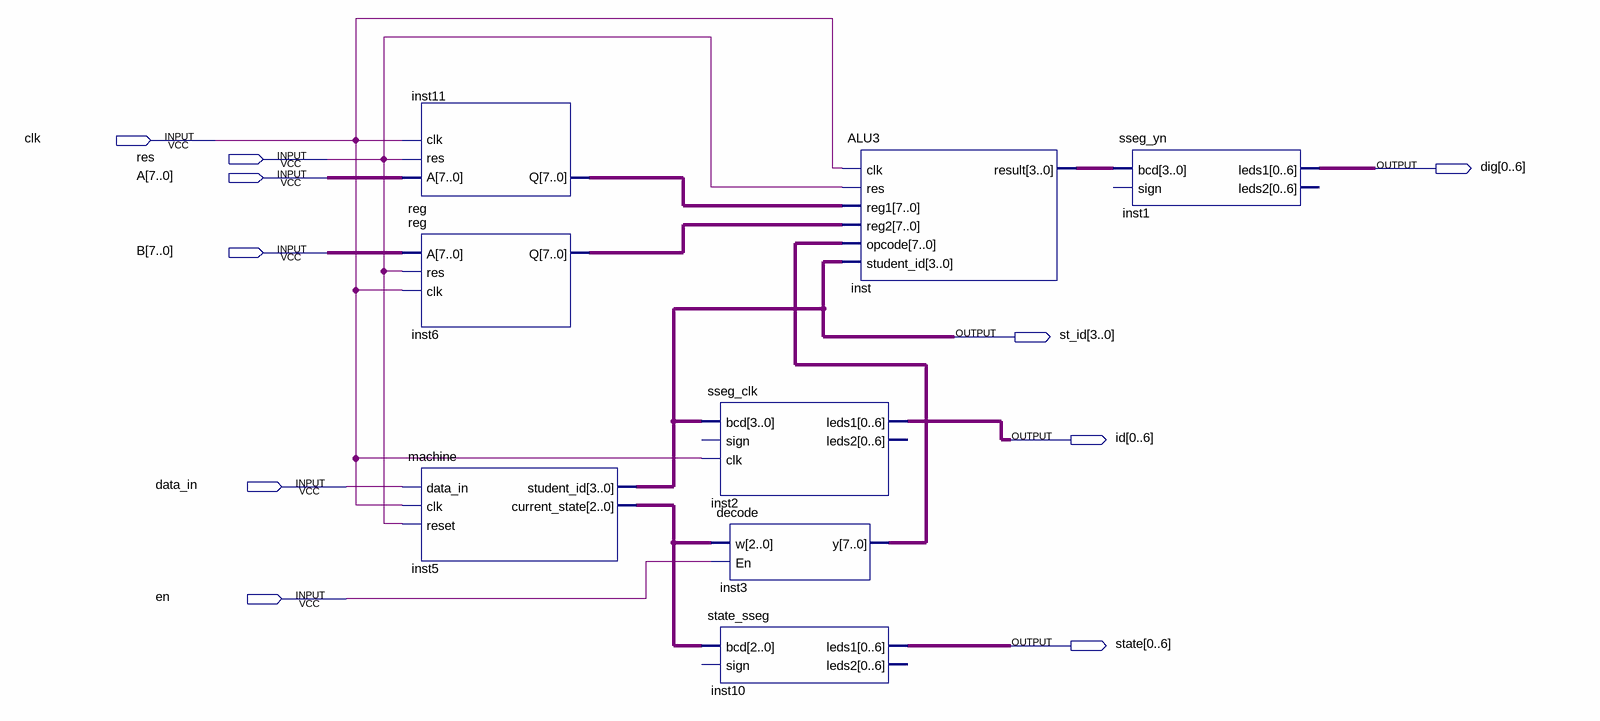
[diagram p0: schematic sheet]
// Quartus schematic CPU_design3.bdf as structural Verilog: 8 symbols, 10 pins
module CPU_design3 (
  input  clk,
  input  res,
  input  [7:0] A,
  input  [7:0] B,
  input  data_in,
  input  en,
  output [0:6] dig,
  output [3:0] st_id,
  output [0:6] id,
  output [0:6] state
);

  wire [2:0] inst5_current_state;
  wire [3:0] inst_result;
  wire [7:0] inst3_y, inst6_q, inst11_q;

  \reg  inst11 (.A(A), .res(res), .clk(clk), .Q(inst11_q));
  \reg  inst6 (.A(B), .res(res), .clk(clk), .Q(inst6_q));
  machine inst5 (.data_in(data_in), .clk(clk), .reset(res), .student_id(st_id), .current_state(inst5_current_state));
  sseg_clk inst2 (.bcd(st_id), .clk(clk), .leds1(id));  // open: sign, leds2
  state_sseg inst10 (.bcd(inst5_current_state), .leds1(state));  // open: sign, leds2
  decode inst3 (.w(inst5_current_state), .En(en), .y(inst3_y));
  ALU3 inst (
    .clk(clk), .res(res), .reg1(inst11_q), .reg2(inst6_q), .opcode(inst3_y), .student_id(st_id),
    .result(inst_result));
  sseg_yn inst1 (.bcd(inst_result), .leds1(dig));  // open: sign, leds2
endmodule
